# EAGLE design SparkFun_MicroMod_DA16200_Function (EAGLE 9.5.1)
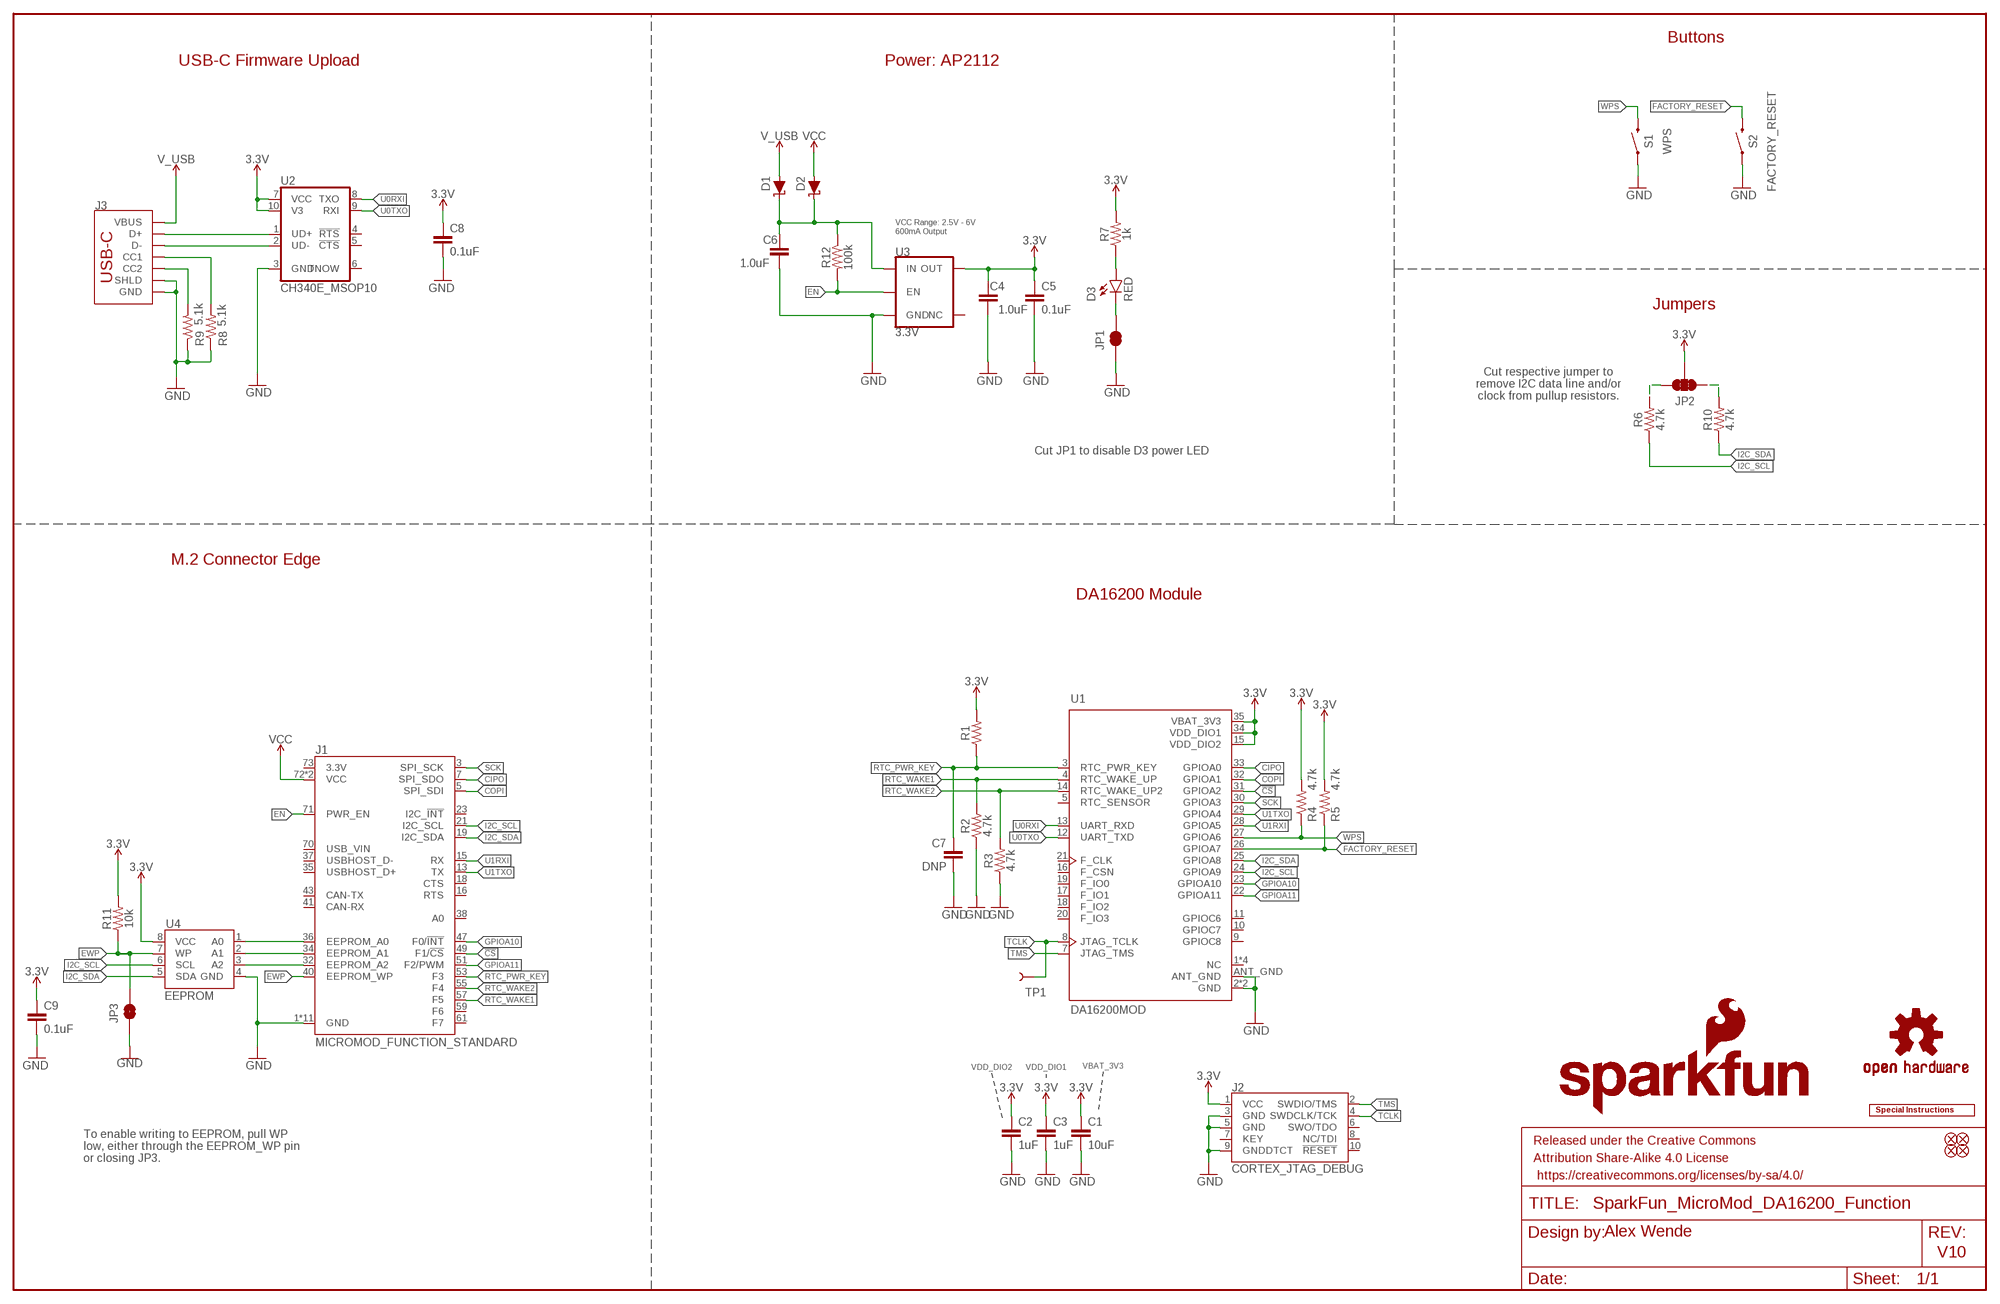
[diagram p0: schematic, sheet 1]

## Parts
C1  10uF  10UF-0603-6.3V-20%  [0603]
C2  1uF  1.0UF-0603-16V-10%  [0603]
C3  1uF  1.0UF-0603-16V-10%  [0603]
C4  1.0uF  1.0UF-0603-16V-10%  [0603]
C5  0.1uF  0.1UF-0603-25V-(+80/-20%)  [0603]
C6  1.0uF  1.0UF-0603-16V-10%  [0603]
C7  DNP  CAP-0603  [0603]
C8  0.1uF  0.1UF-0603-25V-(+80/-20%)  [0603]
C9  0.1uF  0.1UF-0603-25V-(+80/-20%)  [0603]
D1  DIODE-SCHOTTKY-BAT60A  [SOD-323]
D2  DIODE-SCHOTTKY-BAT60A  [SOD-323]
D3  RED  LED-0603_RIGHT_ANGLE  [LED-0603]
FD1  FIDUCIAL1X2  [FIDUCIAL-1X2]
FD2  FIDUCIAL1X2  [FIDUCIAL-1X2]
FD3  FIDUCIAL1X2  [FIDUCIAL-1X2]
FD4  FIDUCIAL1X2  [FIDUCIAL-1X2]
FRAME2  FRAME-LEDGER  [CREATIVE_COMMONS]
J1  MICROMOD_FUNCTION_STANDARD  [M.2-CARD-E-22_FUNCTION_STANDARD]
J2  CORTEX_JTAG_DEBUG  CORTEX_JTAG_DEBUG_PTH_NS  [2X5-PTH-1.27MM-NO_SILK]
J3  USB_C_2-LAYER_PADS  [USB-C-16P-2LAYER-PADS]
JP1  JUMPER-SMT_2_NC_TRACE_SILK  [SMT-JUMPER_2_NC_TRACE_SILK]
JP2  JUMPER-SMT_3_2-NC_TRACE_SILK  [SMT-JUMPER_3_2-NC_TRACE_SILK]
JP3  JUMPER-SMT_2_NO_SILK  [SMT-JUMPER_2_NO_SILK]
LOGO1  SFE_LOGO_NAME_FLAME.2_INCH  [SFE_LOGO_NAME_FLAME_.2]
LOGO2  OSHW-LOGOS  [OSHW-LOGO-S]
LOGO3  SPECIAL_INSTRUCTIONS-ORDERING  [ORDERING_INSTRUCTIONS]
R1  RESISTOR0603  [0603]
R2  4.7k  4.7KOHM-0603-1/10W-1%  [0603]
R3  4.7k  4.7KOHM-0603-1/10W-1%  [0603]
R4  4.7k  4.7KOHM-0603-1/10W-1%  [0603]
R5  4.7k  4.7KOHM-0603-1/10W-1%  [0603]
R6  4.7k  4.7KOHM-0603-1/10W-1%  [0603]
R7  1k  1KOHM-0402T-1/16W-1%  [0402-TIGHT]
R8  5.1k  5.1KOHM-0402T-1/16W-1%  [0402-TIGHT]
R9  5.1k  5.1KOHM-0402T-1/16W-1%  [0402-TIGHT]
R10  4.7k  4.7KOHM-0603-1/10W-1%  [0603]
R11  10k  10KOHM-0603-1/10W-1%  [0603]
R12  100k  100KOHM-0603-1/10W-1%  [0603]
S1  WPS  MOMENTARY-SWITCH-SPST-SMD-5.2MM-TALL  [TACTILE_SWITCH_SMD_5.2MM]
S2  FACTORY_RESET  MOMENTARY-SWITCH-SPST-SMD-5.2MM-TALL  [TACTILE_SWITCH_SMD_5.2MM]
TP1  TEST-POINT3  [PAD.03X.03]
U1  DA16200MOD  DA16200MOD-AAC4WA32  [XCVR_DA16200MOD-AAC4WA32]
U2  CH340E_MSOP10  [MSOP10]
U3  3.3V  V_REG_AP2112K-3.3V  [SOT23-5]
U4  EEPROM  EEPROM-I2C512K  [SO08]

## Nets
3.3V: C1.1 C2.1 C3.1 C4.1 C5.1 C8.1 C9.1 J2.1(VCC) JP2.2 R1.2 R4.2 R5.2 R7.2 R11.2 U1.15(VDD_DIO2) U1.34(VDD_DIO1) U1.35(VBAT_3V3) U2.7(VCC) U2.10(V3) U3.5(OUT) U4.8(VCC)
!CS!: J1.49(F1/!CS!) U1.31(GPIOA2)
CIPO: J1.7(SPI_SDO) U1.33(GPIOA0)
COPI: J1.5(SPI_SDI) U1.32(GPIOA1)
EN: J1.71(PWR_EN) R12.2 U3.3(EN)
EWP: J1.40(EEPROM_WP) JP3.2 R11.1 U4.7(WP)
FACTORY_RESET: R5.1 S2.3 U1.26(GPIOA7)
GND: C1.2 C2.2 C3.2 C4.2 C5.2 C6.2 C7.2 C8.2 C9.2 J1.1(GND) J1.33(GND) J1.39(GND) J1.45(GND) J1.75(GND) J1.GND1(GND) J1.GND2(GND) J1.GND3(GND) J1.GND4(GND) J1.GND5(GND) J1.GND6(GND) J2.3(GND) J2.5(GND) J2.9(GNDDTCT) J3.GND J3.GND2(GND) J3.SHLD1(SHLD) J3.SHLD2(SHLD) J3.SHLD3(SHLD) J3.SHLD4(SHLD) JP1.1 JP3.1 R2.1 R3.1 R8.1 R9.1 S1.1 S2.1 U1.2(GND) U1.ANT_GND U1.GND U2.3(GND) U3.2(GND) U4.4(GND)
GPIOA10: J1.47(F0/!INT!) U1.23(GPIOA10)
GPIOA11: J1.51(F2/PWM) U1.22(GPIOA11)
I2C_SCL: J1.21(I2C_SCL) R6.1 U1.24(GPIOA9) U4.6(SCL)
I2C_SDA: J1.19(I2C_SDA) R10.1 U1.25(GPIOA8) U4.5(SDA)
N$1: J1.36(EEPROM_A0) U4.1(A0)
N$2: J3.A5(CC1) R8.2
N$3: C6.1 D1.C D2.C R12.1 U3.1(IN)
N$5: J3.B5(CC2) R9.2
N$6: D3.C JP1.2
N$7: D3.A R7.1
N$8: J1.32(EEPROM_A2) U4.3(A2)
N$9: J1.34(EEPROM_A1) U4.2(A1)
N$10: J3.A6(D+) J3.B6(D+) U2.1(UD+)
N$11: J3.A7(D-) J3.B7(D-) U2.2(UD-)
N$13: JP2.1 R10.2
N$14: JP2.3 R6.2
RTC_PWR_KEY: C7.1 J1.53(F3) R1.1 U1.3(RTC_PWR_KEY)
RTC_WAKE1: J1.57(F5) R2.2 U1.4(RTC_WAKE_UP)
RTC_WAKE2: J1.55(F4) R3.2 U1.14(RTC_WAKE_UP2)
SCK: J1.3(SPI_SCK) U1.30(GPIOA3)
TCLK: J2.4(SWDCLK/TCK) TP1.1 U1.8(JTAG_TCLK)
TMS: J2.2(SWDIO/TMS) U1.7(JTAG_TMS)
U0RXI: U1.13(UART_RXD) U2.8(TXO)
U0TXO: U1.12(UART_TXD) U2.9(RXI)
U1RXI: J1.15(RX) U1.28(GPIOA5)
U1TXO: J1.13(TX) U1.29(GPIOA4)
V_USB: D1.A J3.VBUS1(VBUS) J3.VBUS2(VBUS)
VCC: D2.A J1.72(VCC) J1.74(VCC)
WPS: R4.1 S1.3 U1.27(GPIOA6)
Unconnected: J1.16(RTS) J1.18(CTS) J1.23(I2C_!INT!) J1.35(USBHOST_D+) J1.37(USBHOST_D-) J1.38(A0) J1.41(CAN-RX) J1.43(CAN-TX) J1.59(F6) J1.61(F7) J1.70(USB_VIN) J1.73(3.3V) J2.6(SWO/TDO) J2.7(KEY) J2.8(NC/TDI) J2.10(!RESET) U1.1(NC) U1.5(RTC_SENSOR) U1.6(NC) U1.9(GPIOC8) U1.10(GPIOC7) U1.11(GPIOC6) U1.16(F_CSN) U1.17(F_IO1) U1.18(F_IO2) U1.19(F_IO0) U1.20(F_IO3) U1.21(F_CLK) U1.36(NC) U1.37(NC) U2.4(!RTS) U2.5(!CTS) U2.6(TNOW) U3.4(NC)

## Notes on the sheet
- Buttons
- USB-C Firmware Upload | Power: AP2112
- VCC Range: 2.5V - 6V 
  600mA Output
- Jumpers
- Cut respective jumper to
  remove I2C data line and/or
  clock from pullup resistors.
- Cut JP1 to disable D3 power LED
- M.2 Connector Edge
- DA16200 Module
- VDD_DIO2 | VDD_DIO1 | VBAT_3V3
- To enable writing to EEPROM, pull WP
  low, either through the EEPROM_WP pin
  or closing JP3.
- Alex Wende
- V10

## Library data of the parts
C1 = SparkFun-Capacitors:10UF: 10.0µF ceramic capacitors A capacitor is a passive two-terminal electrical component used to store electrical energy temporarily in an electric field.; PROD_ID: CAP-11015
C2 C3 = SparkFun-Capacitors:1.0UF: 1µF ceramic capacitors A capacitor is a passive two-terminal electrical component used to store electrical energy temporarily in an electric field.; PROD_ID: CAP-00868; VALUE: 1.0uF
C4 C6 = SparkFun-Capacitors:1.0UF: 1µF ceramic capacitors A capacitor is a passive two-terminal electrical component used to store electrical energy temporarily in an electric field.; PROD_ID: CAP-00868
C5 C8 C9 = SparkFun-Capacitors:0.1UF: 0.1µF ceramic capacitors A capacitor is a passive two-terminal electrical component used to store electrical energy temporarily in an electric field.; PROD_ID: CAP-00810
C7 = SparkFun-Capacitors:CAP
D1 D2 = SparkFun-DiscreteSemi:DIODE-SCHOTTKY: Schottky diode A Schottky diode is a semiconductor diode which has a low forward voltage drop and a very fast switching action.; PROD_ID: DIO-14072; VALUE: 3A/10V/280mV
D3 = SparkFun-MicroMod-Function:LED-0603_RIGHT_ANGLE
FD1-FD4 = SparkFun-Aesthetics:FIDUCIAL: Fiducial Alignment Points Point-of-reference for pick-and-place machines and other optical instruments.
FRAME2 = SparkFun-Aesthetics:FRAME-LEDGER: Schematic Frame - Ledger Standard 11x14 US Ledger frame
J1 = SparkFun-MicroMod:MICROMOD_FUNCTION: MicroMod Connector Description: A card edge connector and mating PCB connector to allow various MicroMod Processor Boards to be coupled with various carrier boards of different capabilities. Based on the M.2 standard.
J2 = SparkFun-Connectors:CORTEX_JTAG_DEBUG: Cortex Debug Connector - 10 pin Supports JTAG debug, Serial Wire debug, and Serial Wire Viewer. PTH and SMD connector options available. General Connector Information <http://infocenter.arm.com/help/topic/com.arm.doc.faqs/attached/13634/cortex_debug_connectors.pdf> Products: PTH Connector <http://www.digikey.com/product-detail/en/cnc-tech/3220-10-0100-00/1175-1627-ND/3883661> -via Digi-Key SparkFun PSoc <https://www.sparkfun.com/products/13229> SparkFun T <https://www.sparkfun.com/products/13810>
J3 = SparkFun-Connectors:USB_C: USB Type C 16Pin Connector Super Speed pins not available on the 16-pin purely SMD connector so this part is best for USB 2.0 implementations. D1 and D2 are tied together enabling D+/- no matter which way the cable is plugged into the connector. The two channel configuration pins (CC1/2) are exposed. These are normally connected to ground via 5.1k resistors but can be reconfigured for high current/high power applications. **4-LAYER BOARD WARNING!!** If designing 4-layer board, make sure to select the variant _4-LAYER-ISOLATED. The linked footprint (USB-C-16-4LAYER-ISOLATED) includes some very necessary cutout polygons in the inner layers (2 and 15). This prevents the PTH mounting shield legs on the USB connector from electrically connecting any other polygons on the inner layers (usually VCC and GND).; PROD_ID: CONN-14122
JP1 = SparkFun-Jumpers:JUMPER-SMT_2_NC_TRACE: Normally closed trace jumper This jumper has a trace between two pads so it's normally closed (NC). Use a razor knife to open the connection. For best results follow the IPC guidelines for cutting traces: Cutout at least 0.063 mm (0.005 in). Remove all loose material to clean up the cut area. Seal the cut with an approved epoxy. Reapply solder to reclose the connection.
JP2 = SparkFun-Jumpers:JUMPER-SMT_3_2-NC_TRACE: Normally closed trace jumper (2 of 2 connections) This jumper has a trace between all three pads so they are normally closed (NC). Use a razor knife to open the connection(s). For best results follow the IPC guidelines for cutting traces: Cutout at least 0.063 mm (0.005 in). Remove all loose material to clean up the cut area. Seal the cut with an approved epoxy. Reapply solder to reclose the connection(s).
JP3 = SparkFun-Jumpers:JUMPER-SMT_2_NO: Normally open jumper This jumper has two pads in close proximity to each other. Apply solder to close the connection. Round pads are easier to solder for beginners, but are a lot larger. SparkFun Product that uses the round pads: SparkFun EL Sequencer <https://www.sparkfun.com/products/12781>
LOGO1 = SparkFun-Aesthetics:SFE_LOGO_NAME_FLAME: SparkFun Font Logo w/ Flame This is the SparkFun full logo. The logo on the schematic will always be the same size; the package variant is the height of the flame part of the logo. Default layer for the logo on the board is tSilk.
LOGO2 = SparkFun-Aesthetics:OSHW-LOGO: Open-Source Hardware (OSHW) Logo This logo indicates the piece of hardware it is found on incorporates a OSHW license and/or adheres to the definition of open source hardware found here: http://freedomdefined.org/OSHW
LOGO3 = SparkFun-Aesthetics:SPECIAL_INSTRUCTIONS: Special Ordering/Production Instructions Alert Symbol for special PCB ordering instructions or unique production process warnings. Ordering Instructions Production Instructions Types of information that should be added to box: Copper weight Soldermask color Silk color PCB thickness Number of layers PCB Standard: 1.6mm FR4 1 oz copper immersion silver plating red soldermask white silkscreen Types of information that should be added to box: Special wash requirements Depaneling instructions Humidification Glue curing Default text settings: 0.07 inch 9% ratio 50% line distance
R1 = SparkFun-Resistors:RESISTOR: Generic Resistor Package
R2-R6 R10 = SparkFun-Resistors:4.7KOHM: 4.7kΩ resistor A resistor is a passive two-terminal electrical component that implements electrical resistance as a circuit element. Resistors act to reduce current flow, and, at the same time, act to lower voltage levels within circuits. - Wikipedia; PROD_ID: RES-07857
R7 = SparkFun-Resistors:1KOHM: 1kΩ resistor A resistor is a passive two-terminal electrical component that implements electrical resistance as a circuit element. Resistors act to reduce current flow, and, at the same time, act to lower voltage levels within circuits. - Wikipedia; PROD_ID: RES-14342
R8 R9 = SparkFun-Resistors:5.1KOHM; PROD_ID: RES-14340
R11 = SparkFun-Resistors:10KOHM: 10kΩ resistor A resistor is a passive two-terminal electrical component that implements electrical resistance as a circuit element. Resistors act to reduce current flow, and, at the same time, act to lower voltage levels within circuits. - Wikipedia; PROD_ID: RES-00824
R12 = SparkFun-Resistors:100KOHM: 100kΩ resistor A resistor is a passive two-terminal electrical component that implements electrical resistance as a circuit element. Resistors act to reduce current flow, and, at the same time, act to lower voltage levels within circuits. - Wikipedia; PROD_ID: RES-07828
S1 S2 = SparkFun-Switches:MOMENTARY-SWITCH-SPST: Momentary Switch (Pushbutton) - SPST Normally-open (NO) SPST momentary switches (buttons, pushbuttons). Variants PTH-12MM - 12mm square, through-hole Momentary Pushbutton Switch - 12mm Square <https://www.sparkfun.com/products/9190> (COM-09190) PTH-6.0MM, PTH-6.0MM-KIT - 6.0mm square, through-hole Mini Pushbutton Switch <https://www.sparkfun.com/products/97> (COM-00097) KIT package intended for soldering kit's - only one side of pads' copper is exposed. PTH-RIGHT-ANGLE-KIT - Right-angle, through-hole Right Angle Tactile Button <https://www.sparkfun.com/products/10791> - Used on SparkFun BigTime Watch Kit <https://www.sparkfun.com/products/11734> SMD-12MM - 12mm square, surface-mount Tactile Button - SMD (12mm) <https://www.sparkfun.com/products/12993> (COM-12993) Used on SparkFun PicoBoard <https://www.sparkfun.com/products/11888> SMD-4.5MM - 4.5mm Square Trackball Switch Used on SparkFun Blackberry Trackballer Breakout <https://www.sparkfun.com/products/13169> SMD-4.6MMX2.8MM - 4.60mm x 2.80mm, surface mount Used on SparkFun Pro Micro - RP2040 <https://www.sparkfun.com/products/17717> SMD-5.2MM, SMD-5.2-REDUNDANT - 5.2mm square, surface-mount Mini Pushbutton Switch - SMD <https://www.sparkfun.com/products/8720> (COM-08720) Used on Arduino Pro Mini <https://www.sparkfun.com/products/11114> REDUNDANT package connects both switch circuits together SMD-6.0X3.5MM - 6.0 x 3.5mm, surface mount Momentary Reset Switch SMD <https://www.sparkfun.com/products/8229> (COM-08229) SMD-6.2MM-TALL - 6.2mm square, surface mount Tactile Button - SMD (6mm) <https://www.sparkfun.com/products/12992> Used on SparkFun Digital Sandbox <https://www.sparkfun.com/products/12651> SMD-RIGHT-ANGLE - Right-angle, surface mount Used on SparkFun Block for Intel® Edison - Arduino <https://www.sparkfun.com/products/13036>; PROD_ID: SWCH-14139
TP1 = SparkFun-Connectors:TEST-POINT: SparkFun Test Points Bare copper test points for troubleshooting or In-Circuit-Testing. These are used by our Production team for verifying production board runs using pogo-pins on test beds. SparkFun Products: SparkFun LSM9DS1 Breakout <https://www.sparkfun.com/products/13284> SparkFun PSOC <https://www.sparkfun.com/products/13714> SparkFun Load Cell Amplifier <https://www.sparkfun.com/products/13879>
U1 = DA16200MOD:DA16200MOD-AAC4WA32: Check prices <https://pricing.snapeda.com/parts/DA16200MOD-AAC4WA32/Dialog%20Semiconductor%20GmbH/view-part?ref=eda>; PROD_ID: IC-16179
U2 = SparkFun-IC-Comms:CH340E; PROD_ID: IC-14135
U3 = SparkFun-IC-Power:V_REG_AP2112: AP2112 - 600mA CMOS LDO Regulator w/ Enable The AP2112 is CMOS process low dropout linear regulator with enable function, the regulator delivers a guaranteed 600mA (min.) continuous load current. Features Output Voltage Accuracy: ±1.5% Output Current: 600mA (Min.) Foldback Short Current Protection: 50mA Enable Function to Turn ON/OFF VOUT Low Dropout Voltage (3.3V): 250mV (Typ.) @IOUT=600mA Excellent Load Regulation: 0.2%/A (Typ.) Excellent Line Regulation: 0.02%/V (Typ.) Low Quiescent Current: 55μA (Typ.) Low Standby Current: 0.01μA (Typ.) Low Output Noise: 50μVRMS PSRR: 100Hz -65dB, 1kHz -65dB OTSD Protection Stable with 1.0μF Flexible Cap: Ceramic, Tantalum and Aluminum Electrolytic Operation Temperature Range: -40°C to 85°C ESD: MM 400V, HBM 4000V; PROD_ID: VREG-12457
U4 = SparkFun-IC-Memory:EEPROM-I2C: I2C EEPROMs, 24LC256 and others 24LC256 Series 256 kb I2C 2 Wire (32 k x 8 Bit) 2.5 V Serial EEPROM SMD - SOIC-8 Datasheet SparkFun Products SparkFun UDB5 - PIC UAV Development Board <https://www.sparkfun.com/products/11703> (GPS-11703); PROD_ID: IC-14645

## Board
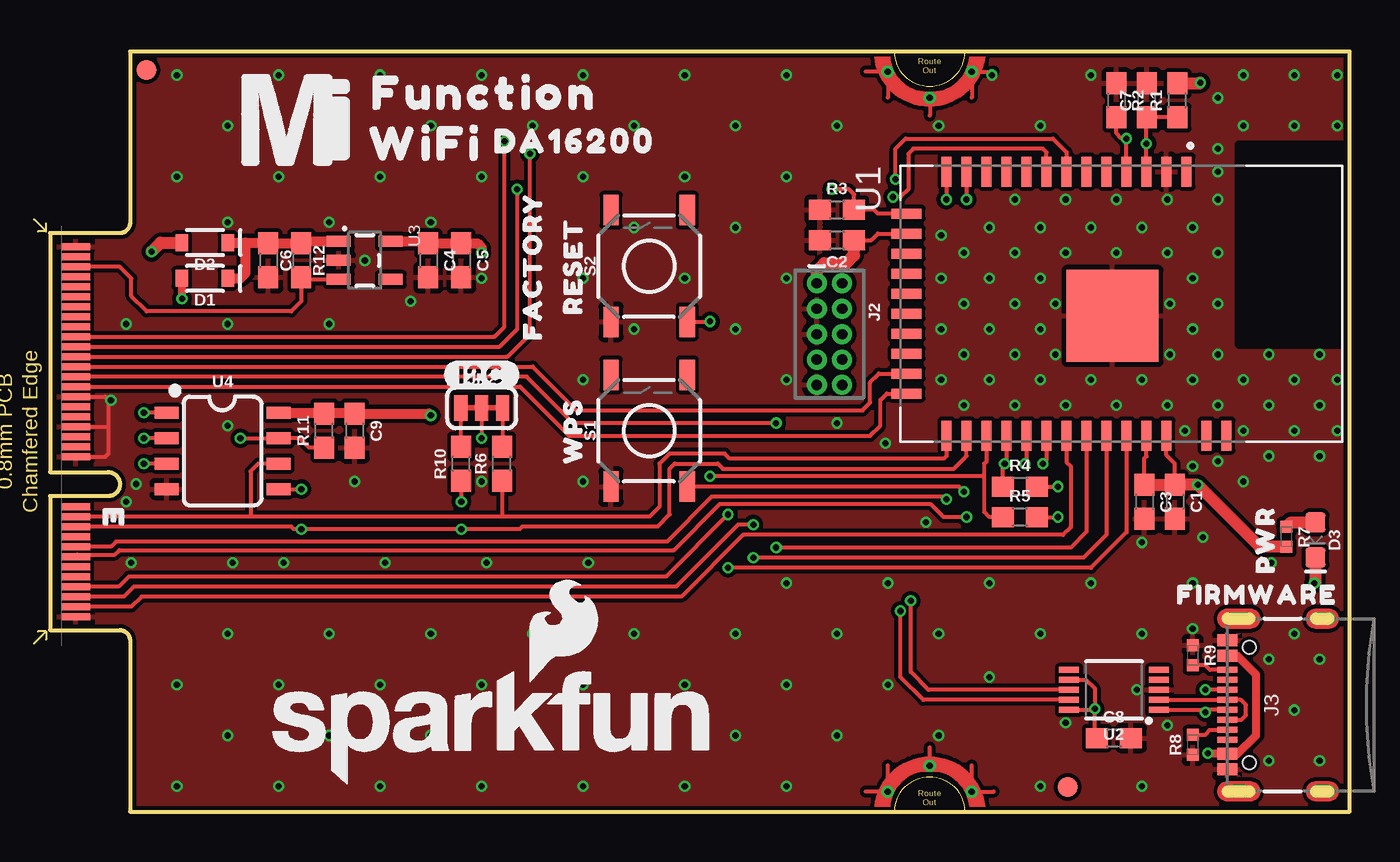
[diagram p1: board, top side]
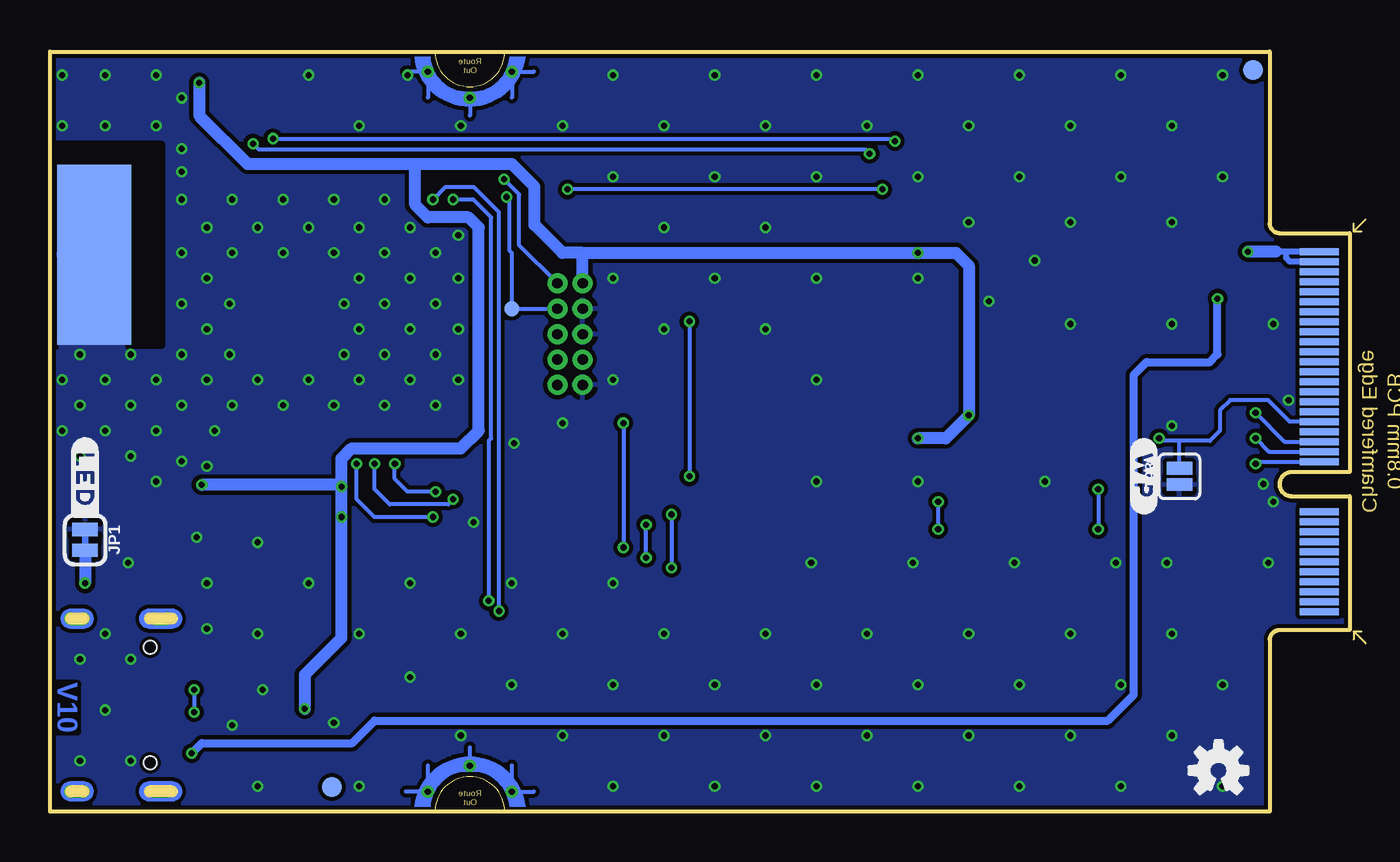
[diagram p2: board, bottom side, seen from below]

Size 65 x 38 mm. Coordinates in mm from the lower left corner, seen from the top.
Outline: 4,0 65,0 65,38 4,38 4,29.4 arc-84 3.5,28.93 0,28.93 0,16.98 2.9,16.98 arc-180 2.9,15.78 0,15.78 0,9.07 3.5,9.07 arc-85 4,8.6 4,0
Copper layers (1*16): Top 0.035mm / dielectric 1.5mm / Bottom 0.035mm
Design rules "SparkFun-2-Layer-Minimum-JLCPCB": minimum track width 5mil, minimum drill 0.3mm, track to track 5mil, track to pad 5mil, pad to pad 5mil, via to via 5mil, smd to smd 5mil, copper to edge 7mil, drill to drill 7mil, minimum pad ring 5mil, minimum via ring 5mil, stop-mask expansion 2.5mil, vias tented up to drill 25mil, thermal gap 10mil

### Footprints (pad centres in the part's own frame; a part is rotated, then mirrored left to right if it is on the bottom)
0603 = smd 1.1 x 1: 1 -0.85,0; 2 0.85,0
SOD-323 = smd 0.63 x 0.83: A 1.15,0; C -1.15,0
LED-0603 = smd 1 x 1: A -0.877,0; C 0.877,0
FIDUCIAL-1X2 = smd 1 x 1: 1 0,0
M.2-CARD-E-22_FUNCTION_STANDARD = smd 0.35 x 1.45: 1 9.25,1.275; 3 8.75,1.275; 5 8.25,1.275; 7 7.75,1.275; 9 7.25,1.275; 11 6.75,1.275; 13 6.25,1.275; 15 5.75,1.275; 17 5.25,1.275; 19 4.75,1.275; 21 4.25,1.275; 23 3.75,1.275; 33 1.25,1.275; 35 0.75,1.275; 37 0.25,1.275; 39 -0.25,1.275; 41 -0.75,1.275; 43 -1.25,1.275; 45 -1.75,1.275; 47 -2.25,1.275; 49 -2.75,1.275; 51 -3.25,1.275; 53 -3.75,1.275; 55 -4.25,1.275; 57 -4.75,1.275; 59 -5.25,1.275; 61 -5.75,1.275; 63 -6.25,1.275; 65 -6.75,1.275; 67 -7.25,1.275; 69 -7.75,1.275; 71 -8.25,1.275; 73 -8.75,1.275; 75 -9.25,1.275 | smd 0.35 x 1.95 bottom: 2 9,1.525; 4 8.5,1.525; 6 8,1.525; 8 7.5,1.525; 10 7,1.525; 12 6.5,1.525; 14 6,1.525; 16 5.5,1.525; 18 5,1.525; 20 4.5,1.525; 22 4,1.525; 32 1.5,1.525; 34 1,1.525; 36 0.5,1.525; 38 0,1.525; 40 -0.5,1.525; 42 -1,1.525; 44 -1.5,1.525; 46 -2,1.525; 48 -2.5,1.525; 50 -3,1.525; 52 -3.5,1.525; 54 -4,1.525; 56 -4.5,1.525; 58 -5,1.525; 60 -5.5,1.525; 62 -6,1.525; 64 -6.5,1.525; 66 -7,1.525; 68 -7.5,1.525; 70 -8,1.525; 72 -8.5,1.525; 74 -9,1.525 | drill 0.305 pad 0.61: GND1 -18,41.9; GND2 -16.7,44; GND3 -18,46.1; GND4 18,41.9; GND5 16.7,44; GND6 18,46.1
2X5-PTH-1.27MM-NO_SILK = drill 0.508 pad 1: 1 -2.54,-0.635; 2 -2.54,0.635; 3 -1.27,-0.635; 4 -1.27,0.635; 5 0,-0.635; 6 0,0.635; 7 1.27,-0.635; 8 1.27,0.635; 9 2.54,-0.635; 10 2.54,0.635
USB-C-16P-2LAYER-PADS = smd 0.3 x 1: A5 -1.25,-0.34; A6 -0.25,-0.34; A7 0.25,-0.34; A8 1.25,-0.34; B5 1.75,-0.34; B6 0.75,-0.34; B7 -0.75,-0.34; B8 -1.75,-0.34 | smd 0.6 x 1: GND -3.225,-0.34; GND2 3.225,-0.34; VBUS1 -2.45,-0.34; VBUS2 2.45,-0.34 | drill 0.4 pad 0.6 long: SHLD1 -4.318,-0.915; SHLD2 4.318,-0.915; SHLD3 -4.318,-5.095; SHLD4 4.318,-5.095 | hole 0.65: -2.89,-1.445; 2.89,-1.445
SMT-JUMPER_2_NC_TRACE_SILK = smd 0.66 x 1.27: 1 -0.521,0; 2 0.521,0
SMT-JUMPER_3_2-NC_TRACE_SILK = smd 0.66 x 1.27: 1 -1.041,0; 2 0,0; 3 1.041,0
SMT-JUMPER_2_NO_SILK = smd 0.635 x 1.27: 1 -0.406,0; 2 0.406,0
0402-TIGHT = smd 0.6 x 0.6: 1 -0.5,0; 2 0.5,0
TACTILE_SWITCH_SMD_5.2MM = smd 1.524 x 0.762: 1 -2.794,1.905; 2 2.794,1.905; 3 -2.794,-1.905; 4 2.794,-1.905
PAD.03X.03 = smd 0.762 x 0.762: 1 0,0
XCVR_DA16200MOD-AAC4WA32 = smd 1.5 x 0.5: 1 -6.6,3.25; 2 -6.6,2.25; 3 -6.6,1.25; 4 -6.6,0.25; 5 -6.6,-0.75; 6 -6.6,-1.75; 7 -6.6,-2.75; 8 -6.6,-3.75; 9 -6.6,-4.75; 10 -6.6,-5.75; 11 -6.6,-6.75; 12 -6.6,-7.75; 13 -6.6,-8.75; 24 6.6,-8.75; 25 6.6,-7.75; 26 6.6,-6.75; 27 6.6,-5.75; 28 6.6,-4.75; 29 6.6,-3.75; 30 6.6,-2.75; 31 6.6,-1.75; 32 6.6,-0.75; 33 6.6,0.25; 34 6.6,1.25; 35 6.6,2.25; 36 6.6,4.25; 37 6.6,5.25 | smd 0.5 x 1.5: 14 -4.5,-10.75; 15 -3.5,-10.75; 16 -2.5,-10.75; 17 -1.5,-10.75; 18 -0.5,-10.75; 19 0.5,-10.75; 20 1.5,-10.75; 21 2.5,-10.75; 22 3.5,-10.75; 23 4.5,-10.75 | smd 9 x 3.7 bottom: ANT_GND -2.45,9.2 | smd 4.6 x 4.6: GND 0.61,-0.45
MSOP10 = smd 1 x 0.3: 1 -2.25,1; 2 -2.25,0.5; 3 -2.25,0; 4 -2.25,-0.5; 5 -2.25,-1; 6 2.25,-1; 7 2.25,-0.5; 8 2.25,0; 9 2.25,0.5; 10 2.25,1
SOT23-5 = smd 0.55 x 1.2: 1 -0.95,-1.3; 2 0,-1.3; 3 0.95,-1.3; 4 0.95,1.3; 5 -0.95,1.3
SO08 = smd 0.6 x 1.2: 1 -1.905,-2.8; 2 -0.635,-2.8; 3 0.635,-2.8; 4 1.905,-2.8; 5 1.905,2.8; 6 0.635,2.8; 7 -0.635,2.8; 8 -1.905,2.8

### Placement (x,y rotation side)
C1  56.26,15.49 270 top
C2  39.37,28.57 180 top
C3  54.74,15.49 270 top
C4  18.92,27.56 270 top
C5  20.57,27.56 270 top
C6  10.92,27.56 270 top
C7  54.86,35.56 90 top
C8  53.21,3.68 0 top
C9  15.24,19.05 270 top
D1  7.75,26.67 180 top
D2  7.75,28.45 180 top
D3  63.3,13.59 270 top
FD1  4.83,37.08 0 top
FD2  4.83,37.08 0 bottom
FD3  50.9,1.24 0 top
FD4  50.9,1.24 0 bottom
FRAME2  3.81,-13.97 0 top  (outside the outline)
J1  0,19 270 top
J2  38.99,23.88 270 top
J3  58.55,5.33 90 top
JP1  63.25,13.59 270 bottom
JP2  21.59,20.19 0 top
JP3  8.51,16.76 90 bottom
LOGO1  22.12,4.22 0 top
LOGO2  6.55,2.06 0 bottom
LOGO3  77.47,44.45 0 top  (outside the outline)
R1  56.39,35.56 90 top
R2  53.34,35.56 270 top
R3  39.37,30.1 0 top
R4  48.51,16.26 0 top
R5  48.51,14.73 0 top
R6  22.61,17.4 90 top
R7  61.85,13.74 270 top
R8  57.15,3.34 90 top
R9  57.15,7.82 270 top
R10  20.57,17.4 90 top
R11  13.72,19.05 90 top
R12  12.57,27.56 270 top
S1  29.97,19.05 90 top
S2  29.97,27.28 90 top
TP1  41.91,25.15 0 bottom
U1  53.59,25.4 270 top
U2  53.21,6.1 180 top
U3  15.75,27.56 270 top
U4  8.64,18.03 270 top
U$1  [FIRMWARE0]  60.38,10.85 0 top
U$2  [PWR0]  60.78,13.59 90 top
U$3  [#LED#0]  63.25,14.48 270 bottom
U$4  [FUNCTION0]  21.72,35.94 0 top
U$5  [DA162000]  26.24,33.53 0 top
U$6  [WIFI0]  18.8,33.4 0 top
U$7  [WPS0]  26.16,19.05 90 top
U$8  [FACTORY0]  24.13,27.28 90 top
U$9  [RESET0]  26.16,27.28 90 top
U$10  [#WP#0]  10.29,16.76 270 bottom
U$11  [#I2C#0]  21.59,21.84 0 top
U$12  [MICROMOD_MI_LOGO_1]  12.32,34.62 0 top

### Tracks (layer width: path | path; a pad name or v marks a point on that pad's centre or on a via)
3.3V  (via drill 0.3)
  Top 0.203: R5.2 v50.42,14.73 | R4.2 v50.42,16.26 | C3.1 54.74,17.65 54.84,17.76 U1.34 | C1.1 56.26,17.4 55.84,17.82 U1.35 | C2.1 41.08,28.57 41.4,28.9 U1.15 | C8.1 52.26,3.79 v52.26,5.14 | U2.10 52.21,5.1 v52.26,5.14 | U2.7 51.82,6.6 52.26,6.16 v52.26,5.14 | JP2.2 v21.59,18.67
  Top 0.508: U3.5 18.82,28.51 C4.1 C5.1 21.38,28.41 21.59,28.19 v21.59,27.94 | U4.8 13.68,19.94 R11.2 13.76,19.94 15.24,19.94 C9.1 18.96,19.9 v19.05,19.81
  Top 0.61: R7.2 60.51,13.24 v57.4,16.34 C1.1 C3.1 | R1.2 57.49,36.41 v57.53,36.45 | J2.1 38.35,27.05 38.73,27.43 39.84,27.43 40.22,27.81 C2.1
  Bottom 0.61: v52.26,5.14 52.26,6.86 50.42,8.7 v50.42,14.73 v50.42,16.26 | v50.42,16.26 50.42,16.34 v57.4,16.34 | v57.53,36.45 57.53,34.8 55.12,32.38 46.74,32.38 | 46.74,32.38 41.91,32.38 40.77,31.24 40.77,29.34 39.37,27.94 38.35,27.94 | J2.1 38.35,27.94 | 38.35,27.94 v21.59,27.94 19.68,27.94 19.05,27.3 v19.05,19.81 20.19,18.67 v21.59,18.67 | 46.74,32.38 46.74,30.35 46.1,29.72 44.07,29.72 43.56,29.21 43.56,19.05 44.45,18.16 49.91,18.16 50.42,17.65 v50.42,16.26
!CS!  (via drill 0.3)
  Top 0.203: U1.31 51.84,14 51.05,13.21 v36.32,13.21 | v36.32,19.43 26.16,19.43 23.84,21.75 J1.49
  Bottom 0.203: v36.32,19.43 v36.32,13.21
CIPO  (via drill 0.3)
  Top 0.203: U1.33 53.84,13.97 52.07,12.19 v33.91,12.19 | v33.91,14.86 30.81,11.76 3.94,11.76 3.43,11.25 J1.7
  Bottom 0.203: v33.91,14.86 v33.91,12.19
COPI  (via drill 0.3)
  Top 0.203: U1.32 52.84,13.86 51.69,12.7 v35.18,12.7 | v35.18,14.35 34.42,14.35 31.32,11.26 4.2,11.26 3.69,10.75 J1.5
  Bottom 0.203: v35.18,12.7 v35.18,14.35
EN
  Top 0.203: J1.71 3.48,27.25 4.06,26.67 4.06,25.78 4.83,25.02 12.06,25.02 12.57,25.53 R12.2 12.67,26.61 U3.3
EWP  (via drill 0.3)
  Top 0.203: R11.1 12.95,18.2 12.48,18.67 U4.7 v9.53,18.67
  Bottom 0.203: J1.40 2.99,19.5 4.06,20.57 5.97,20.57 6.48,20.07 6.48,19.05 6.99,18.54 8.51,18.54 | 8.51,18.54 9.4,18.54 v9.53,18.67 | JP3.2 8.51,18.54
FACTORY_RESET  (via drill 0.3)
  Top 0.203: U1.26 46.84,17.51 46.74,17.4 46.74,16.76 | R5.1 46.99,14.73 46.74,14.99 46.74,16.76 | 46.74,16.76 v33.02,16.76 | S2.3 32.99,24.49 v33.02,24.51
  Bottom 0.203: v33.02,24.51 v33.02,16.76
GND  (via drill 0.3)
  Top 0.203: J1.GND4 42.67,1.77 42.67,2.03 42.94,2.3 J1.GND5 45.07,2.3 46.1,1.27 J1.GND6 | J1.GND1 41.9,36.59 42.16,36.32 42.67,36.32 43.29,35.7 J1.GND2 44.82,35.7 44.83,35.69 45.21,35.69 46.1,36.58 J1.GND3 | J1.33 2.76,17.75 2.92,17.91 2.92,19.25 | J1.45 2.75,20.75 2.92,20.57 2.92,19.25 | J1.39 2.92,19.25
  other vias: 55.88,30.61 58.42,30.61 53.34,30.61 50.8,30.61 48.26,30.61 57.15,29.21 54.61,29.21 52.07,29.21 49.53,29.21 46.99,29.21 58.42,27.94 55.88,27.94 53.34,27.94 50.8,27.94 48.26,27.94 45.72,27.94 44.58,28.83 46.99,26.67 46.99,24.13 46.99,21.59 48.26,25.4 48.26,22.86 48.26,20.32 45.72,20.32 45.72,22.86 45.72,25.4 49.53,26.67 49.53,24.13 49.53,21.59 50.8,20.32 53.34,20.32 55.88,20.32 58.42,20.32 60.96,20.32 63.5,20.32 52.07,21.59 54.61,21.59 57.15,21.59 59.69,21.59 62.23,21.59 64.39,21.59 63.5,22.86 60.96,22.86 58.42,22.86 58.42,25.4 58.42,33.15 58.42,35.69 59.69,34.29 62.23,34.29 64.39,34.29 59.69,36.83 62.23,36.83 64.39,36.83 58.42,32 52.07,36.83 49.53,34.29 47.12,36.83 44.45,34.29 57.15,24.13 57.15,26.67 56.01,25.4 56.01,22.86 50.29,25.4 50.29,22.86 3.81,24.38 3.81,15.49 64.39,19.05 62.23,19.05 59.69,19.05 56.77,19.05 59.69,16.51 63.5,17.78 60.96,17.78 58.42,17.53 57.15,17.27 57.15,11.43 52.07,11.43 61.09,12.45 57.66,13.72 54.61,13.46 57.15,9.14 62.23,8.89 62.23,5.08 63.5,2.54 63.5,7.62 60.96,7.62 60.96,2.54 54.61,1.27 49.53,1.27 50.8,4.45 44.45,3.81 39.37,3.81 34.29,3.81 29.21,3.81 24.13,3.81 19.05,3.81 13.97,3.81 8.89,3.81 6.35,1.27 11.43,1.27 16.51,1.27 21.59,1.27 26.67,1.27 31.75,1.27 36.83,1.27 41.91,6.35 36.83,6.35 31.75,6.35 26.67,6.35 21.59,6.35 16.51,6.35 11.43,6.35 6.35,6.35 46.99,6.73 46.99,11.43 54.36,6.1 55.88,4.32 44.58,21.59 44.58,24.13 44.58,26.67 43.81,14.48 4.06,12.45 6.35,31.75 6.35,36.83 8.89,8.89 8.89,19.3 8.89,24.38 8.89,29.46 8.89,34.29 11.43,31.75 11.43,36.83 13.97,8.89 13.97,24.38 13.97,29.46 13.97,34.29 15.75,27.56 16.51,31.75 16.51,36.83 19.05,8.89 18.03,25.53 19.05,29.46 19.05,34.29 21.59,16.51 21.59,26.67 21.59,31.75 21.59,36.83 24.13,8.89 41.91,11.43 39.37,8.89 39.37,19.43 36.83,11.43 36.83,21.59 36.83,26.67 36.83,31.75 34.29,8.89 34.29,24.13 34.29,29.21 29.21,8.89 29.21,24.13 29.21,29.21 26.67,16.51 26.67,21.59 26.67,26.67 26.67,31.75 31.75,26.67 31.75,31.75 34.29,34.29 39.37,34.29 24.13,34.29 29.21,34.29 26.67,36.83 31.75,36.83 36.83,36.83 15.24,16.51 44.45,8.89 49.53,8.89 54.61,8.89 3.05,20.57 4.32,16.38 9.14,12.45 11.68,12.45 16.76,12.45 21.84,12.45 26.92,12.45 41.78,18.41
  pour Top (isolate 0.203): 0,0 0,38 65,38 65,0
  pour Bottom (isolate 0.203): 0,38 0,0 65,0 65,38
  pour Bottom (isolate 0.305, no thermals): 60.75,24 64.51,24 64.51,22 60.75,22
GPIOA10
  Top 0.203: J1.47 23.5,21.25 25.95,18.8 41.02,18.8 41.53,19.3 41.53,20.57 41.85,20.9 U1.23
GPIOA11
  Top 0.203: J1.51 24.14,22.25 26.32,20.07 40.64,20.07 41.02,20.45 41.02,21.46 41.46,21.9 U1.22
I2C_SCL
  Top 0.203: U1.24 44.84,17.79 44.7,17.65 33.99,17.65 33.74,17.91 30.99,17.91 30.48,17.4 30.48,15.24 29.99,14.75 22.61,14.75 | 22.61,14.75 10.03,14.75 | 10.03,14.75 J1.21 | R6.1 22.61,14.75 | U4.6 10.41,17.4 10.03,17.02 10.03,14.75
I2C_SDA  (via drill 0.3)
  Top 0.203: U1.25 45.85,17.78 45.21,17.14 33.66,17.14 33.4,17.4 31.24,17.4 30.99,17.14 30.99,14.86 30.38,14.25 23.62,14.25 23.5,14.12 v20.57,14.12 v12.57,14.12 12.19,14.12 12.06,14.25 J1.19 | U4.5 v12.57,16.13 | R10.1 v20.57,15.49
  Bottom 0.203: v20.57,14.12 v20.57,15.49 | v12.57,16.13 v12.57,14.12
N$1  (via drill 0.3)
  Top 0.203: U4.1 v4.7,19.94
  Bottom 0.203: v4.7,19.94 3.26,18.5 J1.36
N$2
  Top 0.203: R8.2 57.78,3.85 58.02,4.08 J3.A5
N$3
  Top 0.508: D2.C 9.78,28.45 | 9.78,28.45 10.88,28.45 C6.1 R12.1 12.67,28.51 U3.1 | D1.C 9.53,26.67 9.78,26.92 9.78,28.45
N$5
  Top 0.203: J3.B5 58.02,7.08 57.78,7.32 R9.2
N$6  (via drill 0.3)
  Top 0.61: D3.C 63.3,11.48 v63.25,11.43
  Bottom 0.61: JP1.2 v63.25,11.43
N$7
  Top 0.61: R7.1 62.07,14.47 D3.A
N$8  (via drill 0.3)
  Top 0.203: U4.3 v4.7,17.4
  Bottom 0.203: v4.7,17.4 4.6,17.5 J1.32
N$9  (via drill 0.3)
  Top 0.203: U4.2 v4.7,18.67
  Bottom 0.203: v4.7,18.67 4.03,18 J1.34
N$10  (via drill 0.3)
  Top 0.203: J3.A6 57.87,5.08 57.78,5 v57.78,4.97 57.75,4.97 57.62,5.1 U2.1 | J3.B6 57.8,6.08 v57.78,6.1
  Bottom 0.203: v57.78,6.1 v57.78,4.97
N$11
  Top 0.203: U2.2 55.48,5.58 J3.A7 59.57,5.58 59.82,5.33 59.82,4.83 59.58,4.58 J3.B7
N$13
  Top 0.203: R10.2 20.55,18.27 JP2.1
N$14
  Top 0.203: JP2.3 22.63,18.27 R6.2
RTC_PWR_KEY  (via drill 0.3)
  Top 0.203: R1.1 C7.1 54.84,34.71 v54.84,33.4 U1.3 | J1.53 22.88,22.75 24,23.88 v24,32.89
  Bottom 0.203: v54.84,33.4 54.54,33.1 24.21,33.1 v24,32.89
RTC_WAKE1  (via drill 0.3)
  Top 0.203: U1.4 v53.84,33.66 53.59,33.66 53.34,33.91 R2.2 | J1.57 22.23,23.75 22.73,24.26 v22.73,33.53
  Bottom 0.203: v53.84,33.66 22.86,33.66 v22.73,33.53
RTC_WAKE2  (via drill 0.3)
  Top 0.203: J1.55 22.49,23.25 23.37,24.13 v23.37,31.11 | U1.14 41.4,29.9 41.2,30.1 R3.2 40.22,30.86 39.97,31.11 v39.12,31.11
  Bottom 0.203: v23.37,31.11 v39.12,31.11
SCK
  Top 0.203: U1.30 50.84,17.48 51.05,17.27 51.05,14.22 50.67,13.84 34.67,13.84 31.59,10.76 4.58,10.76 4.07,10.25 J1.3
TCLK  (via drill 0.3)
  Top 0.203: U1.8 49.84,32.96 49.66,33.15 43.18,33.15 42.93,32.89 42.93,31.11 42.55,30.73 v42.16,30.73
  Bottom 0.203: J2.4 TP1.1 41.91,27.94 42.04,28.07 42.04,30.61 v42.16,30.73
TMS  (via drill 0.3)
  Top 0.203: U1.7 50.84,32.98 50.16,33.66 42.8,33.66 42.29,33.15 v42.29,31.62
  Bottom 0.203: J2.2 41.53,28.32 41.53,30.86 v42.29,31.62
U0RXI  (via drill 0.3)
  Top 0.203: U1.13 44.84,30.61 v44.83,30.61 | U2.8 43.94,6.1 43.05,6.99 v43.05,10.54
  Bottom 0.203: v43.05,10.54 43.05,18.54 42.93,18.67 42.93,29.72 43.81,30.61 v44.83,30.61
U0TXO  (via drill 0.3)
  Top 0.203: U1.12 v45.84,30.61 v45.85,30.61 | U2.9 43.68,5.6 42.55,6.73 v42.55,10.03
  Bottom 0.203: v42.55,10.03 42.55,29.97 43.81,31.24 45.21,31.24 v45.85,30.61
U1RXI  (via drill 0.3)
  Top 0.203: U1.28 48.84,17.48 v48.77,17.4 | v44.83,15.62 44.7,15.75 33.1,15.75 30.85,13.5 3.31,13.5 3.05,13.25 J1.15
  Bottom 0.203: v44.83,15.62 45.09,15.37 48.01,15.37 48.77,16.13 v48.77,17.4
U1TXO  (via drill 0.3)
  Top 0.203: U1.29 49.84,17.59 v49.66,17.4 | v45.85,14.73 44.7,14.73 44.07,15.37 33.49,15.37 31.2,13.08 3.48,13.08 3.24,12.85 1.37,12.85 J1.13
  Bottom 0.203: v45.85,14.73 48.77,14.73 49.66,15.62 v49.66,17.4
V_USB  (via drill 0.3)
  Top 0.203: 6.6,25.66 v6.6,25.65
  Top 0.406: J3.VBUS2 59.4,7.78 60.33,6.86 60.33,3.81 59.4,2.88 J3.VBUS1 57.95,2.88 v57.91,2.92 | D1.A 6.6,25.66
  Bottom 0.406: v57.91,2.92 57.4,3.43 49.88,3.43 48.77,4.55 12.09,4.55 10.79,5.84 10.79,21.84 10.16,22.48 6.99,22.48 6.6,22.86 v6.6,25.65
VCC  (via drill 0.3)
  Top 0.61: v5.08,28 5.53,28.45 D2.A
  Bottom 0.305: J1.74 3.17,28 | 3.17,28 3.68,28 | J1.72 2.99,27.5 3.17,27.69 3.17,28
  Bottom 0.61: 3.68,28 v5.08,28
WPS  (via drill 0.3)
  Top 0.203: U1.27 47.84,17.49 v47.75,17.4 47.66,17.31 R4.1 | S1.3 45.47,16.26 v45.72,16
  Bottom 0.203: v45.72,16 47.12,16 47.75,16.64 v47.75,17.4

### Text on the board
Bottom: V10
tDocu: 0.8mm PCB / ENIG Finish / 45 degree chamfered edge | Alex Wende